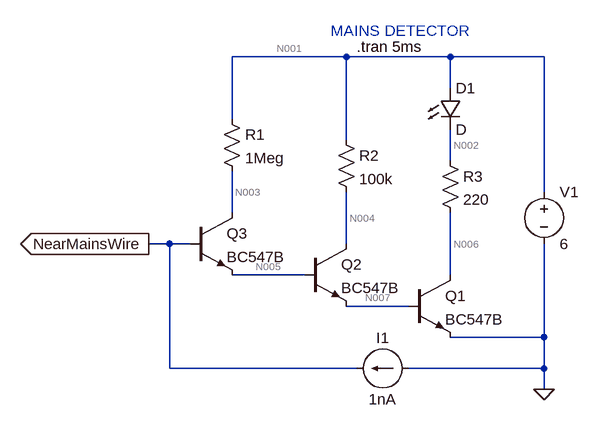
[diagram p0: schematic Mains Detector.asc]
Mains Detector.asc, the LTspice schematic file:
Version 4
SHEET 1 880 680
WIRE 288 -144 112 -144
WIRE 448 -144 288 -144
WIRE 592 -144 448 -144
WIRE 448 -96 448 -144
WIRE 112 -48 112 -144
WIRE 288 -16 288 -144
WIRE 448 16 448 -32
WIRE 592 64 592 -144
WIRE 112 96 112 32
WIRE 16 144 -16 144
WIRE 48 144 16 144
WIRE 288 144 288 64
WIRE 224 192 112 192
WIRE 448 192 448 96
WIRE 384 240 288 240
WIRE 592 288 592 144
WIRE 592 288 448 288
WIRE 16 336 16 144
WIRE 304 336 16 336
WIRE 592 336 592 288
WIRE 592 336 384 336
WIRE 592 368 592 336
FLAG 592 368 0
FLAG -16 144 NearMainsWire
IOPIN -16 144 Out
SYMBOL npn 384 192 R0
SYMATTR InstName Q1
SYMATTR Value BC547B
SYMBOL npn 224 144 R0
SYMATTR InstName Q2
SYMATTR Value BC547B
SYMBOL npn 48 96 R0
SYMATTR InstName Q3
SYMATTR Value BC547B
SYMBOL LED 432 -96 R0
SYMATTR InstName D1
SYMBOL res 96 -64 R0
SYMATTR InstName R1
SYMATTR Value 1Meg
SYMBOL voltage 592 48 R0
WINDOW 123 0 0 Left 0
WINDOW 39 0 0 Left 0
SYMATTR InstName V1
SYMATTR Value 6
SYMBOL res 272 -32 R0
SYMATTR InstName R2
SYMATTR Value 100k
SYMBOL res 432 0 R0
SYMATTR InstName R3
SYMATTR Value 220
SYMBOL current 384 336 R90
WINDOW 0 -32 40 VBottom 2
WINDOW 3 32 40 VTop 2
WINDOW 123 0 0 Left 0
WINDOW 39 0 0 Left 0
SYMATTR InstName I1
SYMATTR Value 1nA
TEXT 304 -160 Left 2 !.tran 5ms
TEXT 264 -184 Left 2 ;MAINS DETECTOR

The netlist it stands for:
* Mains Detector.asc
Q1 N006 N007 0 0 BC547B
Q2 N004 N005 N007 0 BC547B
Q3 N003 NearMainsWire N005 0 BC547B
D1 N001 N002 D
R1 N001 N003 1Meg
V1 N001 0 6
R2 N001 N004 100k
R3 N002 N006 220
I1 0 NearMainsWire 1nA
.model D D
.lib standard.dio
.model NPN NPN
.model PNP PNP
.lib standard.bjt
.tran 5ms
* MAINS DETECTOR
.backanno
.end

* Results of the author's LTspice run, read from the files saved beside the schematic
* Operating Point, zero values left out:
*   V(n006) = 2.254 V
*   V(n007) = 715.1 mV
*   V(n004) = 848.5 mV
*   V(n005) = 1.276 V
*   V(n003) = 5.734 V
*   V(nearmainswire) = 1.698 V
*   V(n001) = 6 V
*   V(n002) = 5.277 V
*   Ic(Q3) = 266.3 nA
*   Ib(Q3) = 1 nA
*   Ie(Q3) = -267.3 nA
*   Ic(Q2) = 51.51 µA
*   Ib(Q2) = 267.3 nA
*   Ie(Q2) = -51.78 µA
*   Ic(Q1) = 13.74 mA
*   Ib(Q1) = 51.78 µA
*   Ie(Q1) = -13.79 mA
*   I(D1) = 13.74 mA
*   I(I1) = 1 nA
*   I(R3) = 13.74 mA
*   I(R2) = 51.51 µA
*   I(R1) = 266.3 nA
*   I(V1) = -13.79 mA